# EAGLE design WiSwitch (EAGLE 7.2.0)
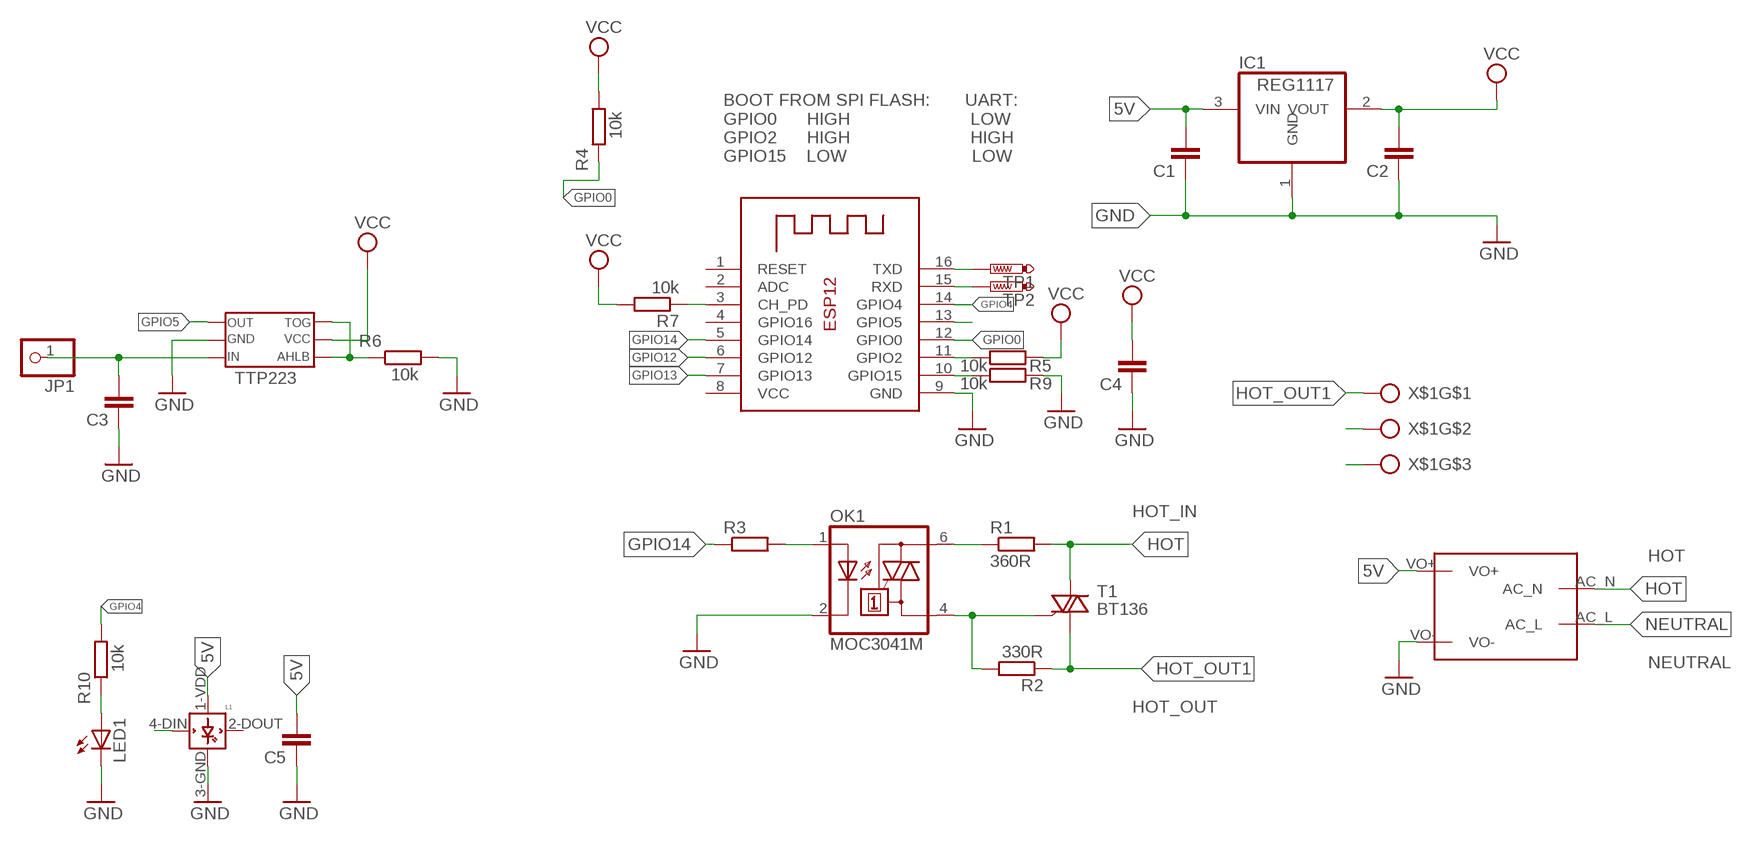
[diagram p0: schematic, sheet 1]

## Parts
C1  C-EUC0805  [C0805]
C2  C-EUC0805  [C0805]
C3  C-EUC0805  [C0805]
C4  C-EUC0805  [C0805]
C5  C-EUC0805  [C0805]
IC1  REG1117  [SOT223]
JP1  PINHD-1X1  [1X01]
L1  WS2812B  [WS2812B]
LED1  LEDCHIP-LED0805  [CHIP-LED0805]
OK1  MOC3041M  [DIL06]
R1  360R  R-EU_0207/10  [0207/10]
R2  330R  R-EU_0207/10  [0207/10]
R3  R-EU_R0805  [R0805]
R4  10k  R-EU_R0805  [R0805]
R5  10k  R-EU_R0805  [R0805]
R6  10k  R-EU_R0805  [R0805]
R7  10k  R-EU_R0603  [R0603]
R9  10k  R-EU_R0805  [R0805]
R10  10k  R-EU_R0805  [R0805]
T1  BT136  [TO220AB]
TP1  PTR1B1,27  [B1,27]
TP2  PTR1B1,27  [B1,27]
U$2  MAINS_CONVERTERS  [HLK-PM01]
U$3  TTP223-BA6  [SOT-23-6L]
X1  ESP-12  [ESP-12]
X$1  ARK3  [ARK3]

## Nets
5V: C1.2 C5.2 IC1.3(VIN) L1.1-VDD(VDD) U$2.VO+
GND: C1.1 C2.1 C3.1 C4.1 C5.1 IC1.1(GND) L1.3-GND(GND) LED1.C OK1.2(C) R6.2 R9.2 U$2.VO- U$3.GND X1.9(GND)
GPIO0: R4.1 X1.12(GPIO0)
GPIO4: R10.2 X1.14(GPIO4)
GPIO5: U$3.OUT X1.13(GPIO5)
GPIO12: X1.6(GPIO12)
GPIO13: L1.4-DIN(DIN) X1.7(GPIO13)
GPIO14: R3.1 X1.5(GPIO14)
HOT: R1.2 T1.2(A2) U$2.AC_N X$1.2
HOT_OUT1: R2.1 T1.1(A1) X$1.1
IN: C3.2 JP1.1 U$3.IN
N$1: OK1.1(A) R3.2
N$2: OK1.6(A2) R1.1
N$3: OK1.4(A1) R2.2 T1.3(G)
N$4: R7.1 X1.3(CH_PD)
N$5: R6.1 U$3.AHLB U$3.TOG
N$7: LED1.A R10.1
N$8: R5.1 X1.11(GPIO2)
N$9: R9.1 X1.10(GPIO15)
NEUTRAL: U$2.AC_L X$1.3
RX: TP2.TP X1.15(RXD)
TX: TP1.TP X1.16(TXD)
VCC: C2.2 C4.2 IC1.2(VOUT) R4.2 R5.2 R7.2 U$3.VCC
Unconnected: L1.2-DOUT(DOUT) X1.1(RESET) X1.2(ADC) X1.4(GPIO16)

## Notes on the sheet
- BOOT FROM SPI FLASH:       UART:
  GPIO0      HIGH                        LOW
  GPIO2      HIGH                        HIGH
  GPIO15    LOW                         LOW
- HOT_IN
- HOT
- NEUTRAL
- HOT_OUT

## Power pins joined to a net without a drawn wire
VCC: X1.8(VCC)

## Library data of the parts
C1-C5 = rcl:C-EU: CAPACITOR, European symbol
IC1 = burr-brown:REG1117: 800mA and 1A Low Dropout (LDO) Positive Regulator 1.8V, 2.5V, 2.85V, 3.3V, 5V, and Adj; MPN: REG1117; OC_FARNELL: 1097566; OC_NEWARK: 14P6981
JP1 = adafruit:PINHD-1X1: Pin header 1x1 for 0.1" spacing With round pins
L1 = adafruit:WS2812B
LED1 = adafruit:LED: LED OSRAM: - CHIPLED LG R971, LG N971, LY N971, LG Q971, LY Q971, LO R971, LY R971 LH N974, LH R974 LS Q976, LO Q976, LY Q976 LO Q996 - Hyper CHIPLED LW Q18S LB Q993, LB Q99A, LB R99A - SideLED LS A670, LO A670, LY A670, LG A670, LP A670 LB A673, LV A673, LT A673, LW A673 LH A674 LY A675 LS A676, LA A676, LO A676, LY A676, LW A676 LS A679, LY A679, LG A679 - Hyper Micro SIDELED® LS Y876, LA Y876, LO Y876, LY Y876 LT Y87S - SmartLED LW L88C, LW L88S LB L89C, LB L89S, LG L890 LS L89K, LO L89K, LY L89K LS L896, LA L896, LO L896, LY L896 - TOPLED LS T670, LO T670, LY T670, LG T670, LP T670 LSG T670, LSP T670, LSY T670, LOP T670, LYG T670 LG T671, LOG T671, LSG T671 LB T673, LV T673, LT T673, LW T673 LH T674 LS T676, LA T676, LO T676, LY T676, LB T676, LH T676, LSB T676, LW T676 LB T67C, LV T67C, LT T67C, LS T67K, LO T67K, LY T67K, LW E67C LS E67B, LA E67B, LO E67B, LY E67B, LB E67C, LV E67C, LT E67C LW T67C LS T679, LY T679, LG T679 LS T770, LO T770, LY T770, LG T770, LP T770 LB T773, LV T773, LT T773, LW T773 LH T774 LS E675, LA E675, LY E675, LS T675 LS T776, LA T776, LO T776, LY T776, LB T776 LHGB T686 LT T68C, LB T68C - Hyper Mini TOPLED® LB M676 - Mini TOPLED Santana® LG M470 LS M47K, LO M47K, LY M47K Source: http://www.osram.convergy.de/
OK1 = optocoupler:MOC30*: 6-Pin DIP Zero-Cross Optoisolators Triac Driver Output (250/400 Volt Peak) Source: Data sheet <http://www.fairchildsemi.com/ds/MO/MOC3031M.pdf> The old path of data sheet not more available 2013-05-06.; MF: FAIRCHILD SEMICONDUCTOR; MPN: MOC3041M; OC_FARNELL: 1086677; OC_NEWARK: 78K6090
R1-R7 R9 R10 = rcl:R-EU_: RESISTOR, European symbol
T1 = triac:BT136: Triac BT136 series E sensitive gate Source: http://www.nxp.com/acrobat_download/datasheets/BT136_SERIES_E_2.pdf
TP1 TP2 = testpad:PTR1: TEST PIN
U$2 = _HLK:MAINS_CONVERTERS
U$3 = TTP_223:TTP223-BA6
X1 = adafruit:ESP-12
X$1 = _ARK:ARK3

## Board
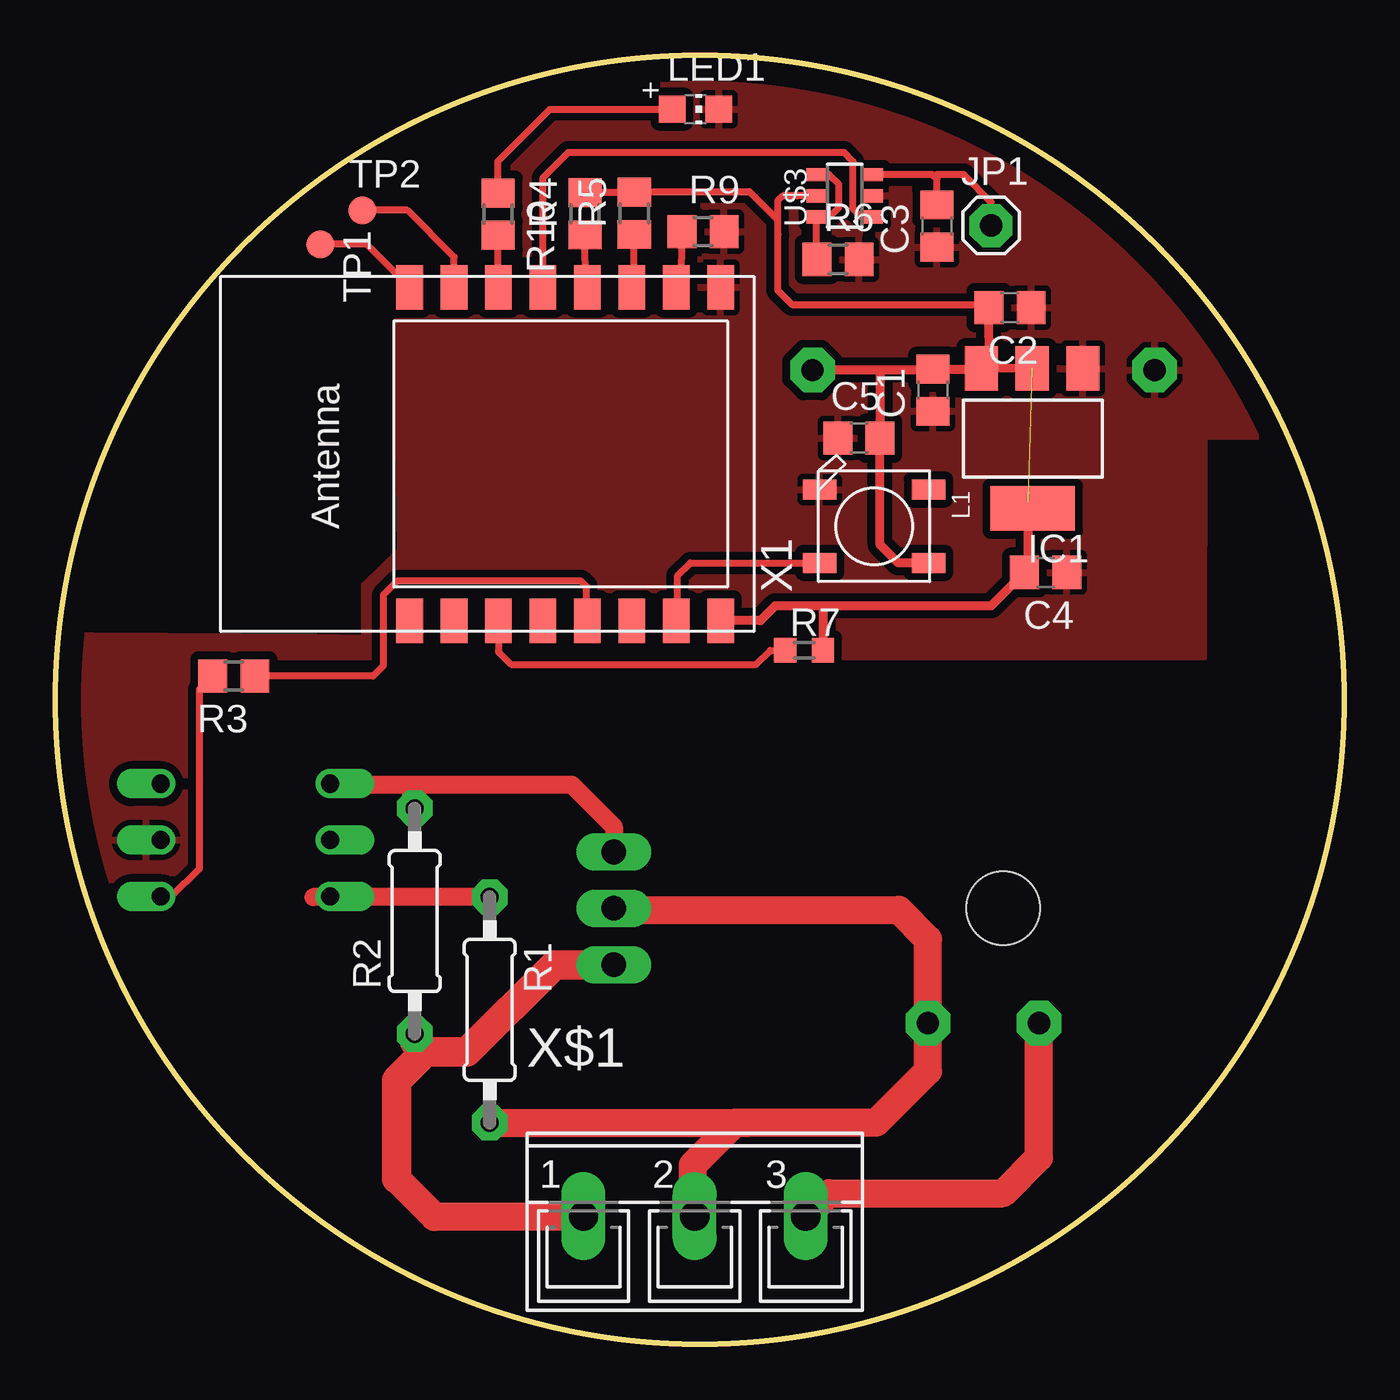
[diagram p1: board, top side]
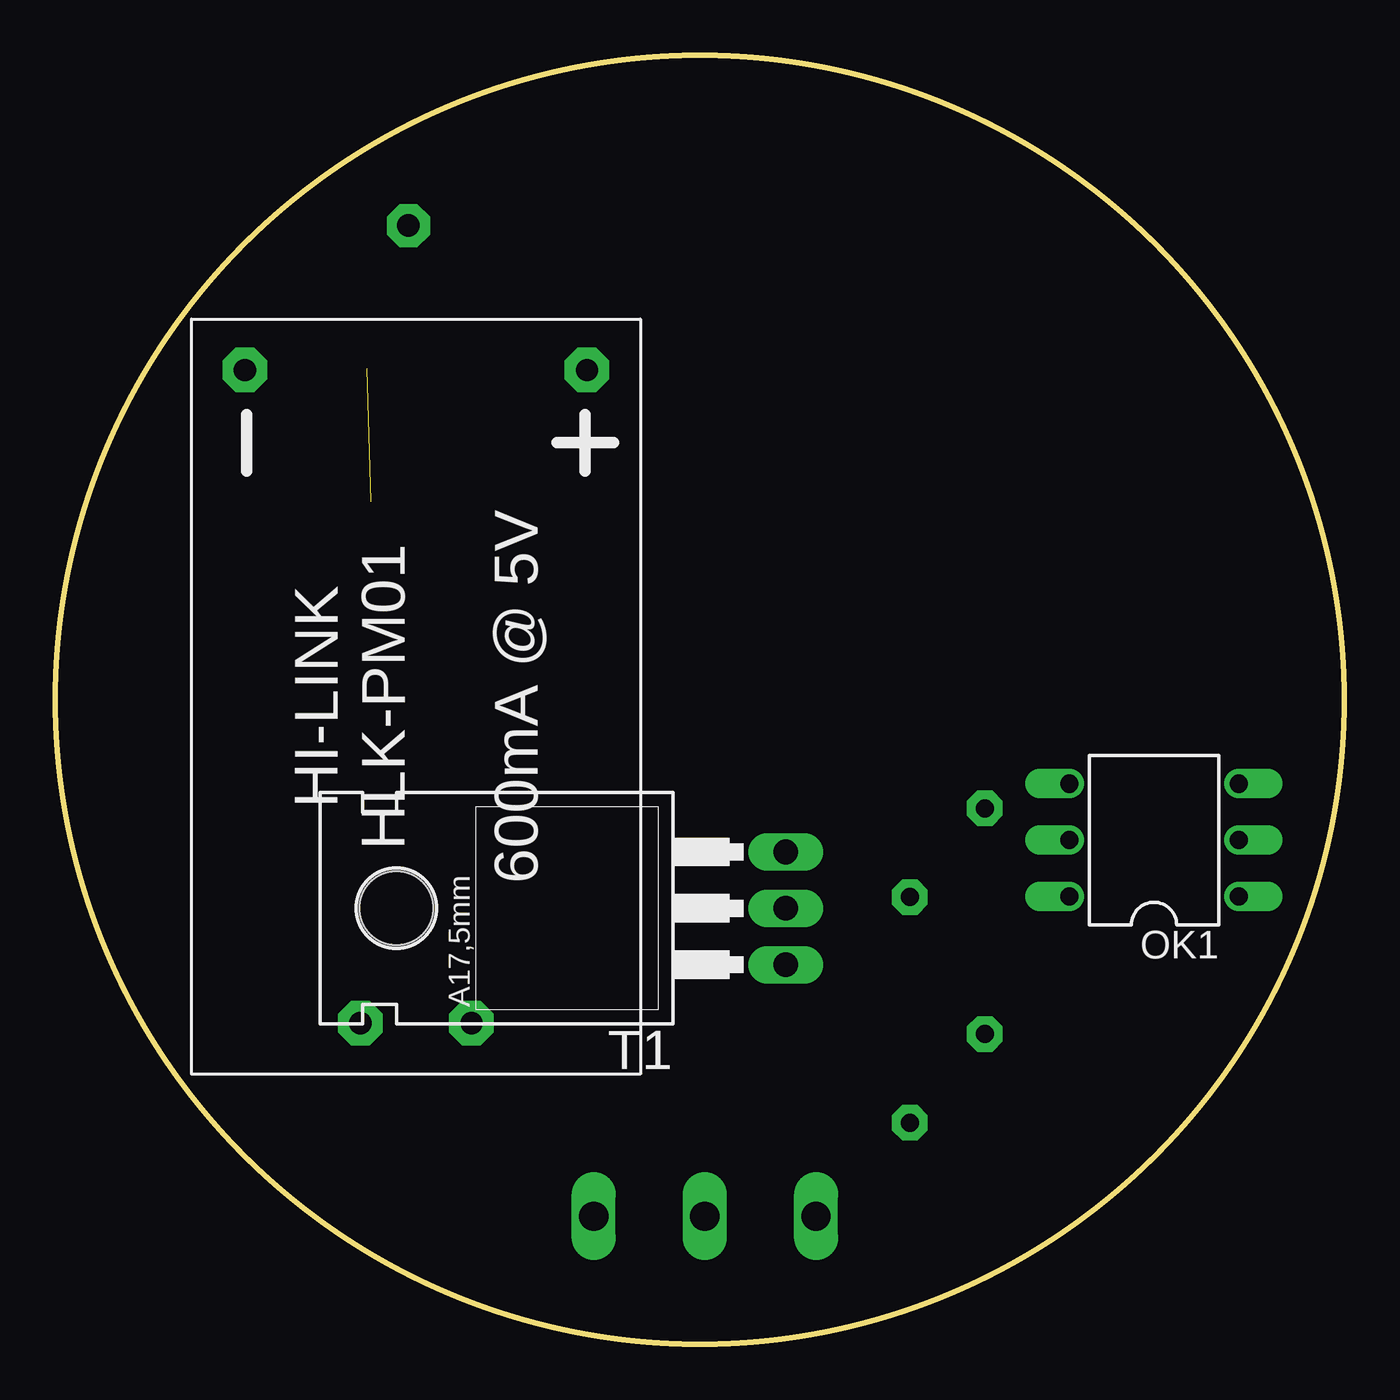
[diagram p2: board, bottom side, seen from below]

Size 58 x 58 mm. Coordinates in mm from the lower left corner, seen from the top.
Outline: circle at 29,29 radius 29
Copper layers (1*16): Top 0.035mm / dielectric 1.5mm / Bottom 0.035mm
Design rules "default": minimum track width 10mil, minimum drill 24mil, track to track 8mil, track to pad 8mil, pad to pad 8mil, via to via 8mil, smd to smd 8mil, copper to edge 40mil, drill to drill 8mil, minimum pad ring 10mil, minimum via ring 8mil, stop-mask expansion 4mil, vias tented up to drill 0mil, thermal gap 10mil

### Footprints (pad centres in the part's own frame; a part is rotated, then mirrored left to right if it is on the bottom)
C0805 = smd 1.3 x 1.5: 1 -0.95,0; 2 0.95,0
SOT223 = smd 1.499 x 2.007: 1 -2.261,-3.15; 2 0.025,-3.15; 3 2.311,-3.15 | smd 3.81 x 2.007: 4 0,3.15
1X01 = drill 1.016 pad 1.93 octagon: 1 0,0
WS2812B = smd 1.5 x 0.9: 1-VDD 2.45,-1.65; 2-DOUT 2.45,1.65; 3-GND -2.45,1.65; 4-DIN -2.45,-1.65
CHIP-LED0805 = smd 1.2 x 1.2: A 0,-1.05; C 0,1.05
DIL06 = drill 0.813 offset: 1 -2.54,-3.81; 2 0,-3.81; 3 2.54,-3.81; 4 2.54,3.81; 5 0,3.81; 6 -2.54,3.81
0207/10 = drill 0.813 pad 1.6 octagon: 1 -5.08,0; 2 5.08,0
R0805 = smd 1.3 x 1.5: 1 -0.95,0; 2 0.95,0
R0603 = smd 1 x 1.1: 1 -0.85,0; 2 0.85,0
TO220AB = drill 1.118 long: 1 -2.54,-6.35; 2 0,-6.35; 3 2.54,-6.35 | hole 3.302: 0,11.176
B1,27 = smd 1.27 x 1.27: TP 0,0
HLK-PM01 = drill 1 pad 2 octagon: AC_L -14.7,2.5; AC_N -14.7,-2.5; VO+ 14.7,-7.7; VO- 14.7,7.7
SOT-23-6L = smd 0.6 x 0.9: AHLB 0.95,1.277; GND 0,-1.277; IN 0.95,-1.277; OUT -0.95,-1.277; TOG -0.95,1.277; VCC 0,1.277
ESP-12 = smd 2 x 1.2: 1 -7.5,4.5; 2 -7.5,2.5; 3 -7.5,0.5; 4 -7.5,-1.5; 5 -7.5,-3.5; 6 -7.5,-5.5; 7 -7.5,-7.5; 8 -7.5,-9.5; 9 7.5,-9.5; 10 7.5,-7.5; 11 7.5,-5.5; 12 7.5,-3.5; 13 7.5,-1.5; 14 7.5,0.5; 15 7.5,2.5; 16 7.5,4.5
ARK3 = drill 1.321 long: 1 -5.004,0; 2 0,0; 3 5.004,0

### Placement (x,y rotation side)
C1  39.5,42.93 90 top
C2  42.97,46.65 180 top
C3  39.67,50.32 90 top
C4  44.57,34.73 180 top
C5  36.16,40.78 0 top
IC1  43.99,40.76 180 top
JP1  42.11,50.34 0 top
L1  36.85,36.81 0 top
LED1  28.81,55.58 270 top
OK1  8.55,22.68 90 bottom
R1  19.54,15.04 270 top
R2  16.17,19.04 90 top
R3  8.02,30.07 180 top
R4  23.84,50.88 90 top
R5  26.05,50.9 90 top
R6  35.23,48.82 0 top
R7  33.7,31.22 0 top
R9  29.15,50.07 0 top
R10  19.92,50.86 270 top
T1  31.48,19.61 90 bottom
TP1  11.91,49.5 270 top
TP2  13.82,51.03 0 top
U$2  41.78,29.14 90 bottom
U$3  35.52,51.69 90 top
X1  20.44,40.06 90 top
X$1  28.77,5.75 0 top

### Tracks (layer width: path | path; a pad name or v marks a point on that pad's centre or on a via)
5V
  Top 0.406: IC1.3 41.65,43.88 C1.2 39.46,43.84 37.13,43.84 | 37.13,43.84 U$2.VO+ | L1.1-VDD 37.94,35.16 37.11,35.99 C5.2 37.13,40.79 37.13,43.84
  Top 0.61: U$2.VO+
GND
  pour Top (isolate 0.356): -4.96,62.67 61.08,62.67 60.9,40.77 51.7,40.85 51.68,30.89 6.47,30.92 7.11,18.22 -4.96,18.22 -4.99,31.94 11.68,31.83 13.91,31.78 13.91,34.17 15.54,35.75 15.36,48.7 -4.96,48.7
GPIO0
  Top 0.305: X1.12 23.86,47.56 R4.1 23.78,49.87
GPIO4
  Top 0.305: X1.14 19.92,47.58 R10.2
GPIO5
  Top 0.305: X1.13 21.94,52.49 23.09,53.65 35.48,53.65 35.9,53.22 35.9,51.1 36.27,50.74 U$3.OUT
GPIO13
  Top 0.305: X1.7 28,32.62 28,34.58 28.58,35.16 L1.4-DIN
GPIO14
  Top 0.305: X1.5 23.91,32.59 23.91,34.09 23.66,34.34 15.37,34.34 14.75,33.72 14.75,30.53 14.29,30.07 R3.1
HOT
  Top 0.813: 31.23,9.96 31.23,9.97 | T1.2 arc90 25.2,19.54
  Top 1.27: X$1.2 28.69,5.83 28.69,8.06 30.6,9.97 31.23,9.97 36.95,9.97 39.28,12.29 U$2.AC_N 39.28,18.22 37.95,19.54 25.2,19.54 | R1.2 31.23,9.96
HOT_OUT1
  Top 0.813: X$1.1 23.74,5.72 | 25.01,16.95 T1.1
  Top 1.27: 23.74,5.72 17.06,5.72 15.36,7.42
  Top 1.321: 15.36,7.42 15.36,11.87 16.63,13.14 | 16.63,13.14 18.53,13.14 22.47,17.08 T1.1 | 16.63,13.14 16.17,13.6 R2.1
IN
  Top 0.305: C3.2 39.67,52.42 | 39.67,52.42 39.45,52.64 U$3.IN | JP1.1 42.11,51.41 40.88,52.64 39.67,52.64 39.67,52.42
N$1
  Top 0.305: R3.2 6.47,29.47 6.47,21.39 5.22,20.14 OK1.1
N$2
  Top 0.813: R1.1 11.6,20.12 OK1.6
N$3
  Top 0.813: T1.3 25.13,23.28 23.23,25.18 16,25.18 | OK1.4 12.4,25.18 16,25.18 | R2.2 16,24.29 16,25.18
N$4
  Top 0.305: X1.3 19.94,31.17 19.93,31.17 20.52,30.59 31.54,30.59 32.17,31.22 R7.1
N$5
  Top 0.305: U$3.TOG 34.27,50.72 | U$3.TOG 34.85,50.74 35.24,51.13 35.24,52.22 34.82,52.64 U$3.AHLB | R6.1 34.25,48.85 U$3.TOG
N$7
  Top 0.305: R10.1 arc-90 R10.1 19.91,53.24 22.26,55.58 LED1.A
N$8
  Top 0.305: X1.11 25.97,47.6 26.05,47.6 R5.1
N$9
  Top 0.305: X1.10 28.19,47.56 R9.1
NEUTRAL
  Top 1.27: X$1.3 34.82,6.79 42.67,6.79 44.28,8.4 U$2.AC_L
RX
  Top 0.305: TP2.TP 15.85,51.03 17.95,48.93 17.95,47.58 X1.15 17.9,47.52
TX
  Top 0.305: X1.16 14.01,49.5 TP1.TP
VCC  (1 unrouted)
  Top 0.305: R4.2 23.86,51.85 R5.2 26.08,51.88 31.23,51.88 32.5,50.6 | 32.5,50.6 32.5,49.97 | 32.5,49.97 32.5,47.43 33.14,46.79 41.88,46.79 C2.2 | 32.53,49.94 32.5,49.97 | U$3.VCC 33.38,51.69 32.74,51.69 32.5,51.46 32.5,50.6
  Top 0.406: IC1.2 42.04,43.93 C2.2 | 43.79,37.92 43.79,34.9 C4.2 42.11,33.22 34.56,33.22 | 34.56,33.22 34.42,33.22 34.42,33.23 32.39,33.23 31.73,32.56 X1.8 | R7.2 34.56,31.24 34.56,33.22

### Text on the board
Name: WiSwitch 2016